# Altium schematic sheet ART-Pi_Content.SchDoc: Content
size A3; DocumentNumber: 1; Revision: V1.5; SheetNumber: 1; SheetTotal: 11; PageSetup: Record=PageOptions|CenterHorizontal=True|CenterVertical=True|PrintScale=1.01|XCorrection=1.00|YCorrection=1.00|PrintKind=0|BorderSize=5000000|LeftOffset=0|BottomOffset=0|Orientation=2|PaperLength=1000|PaperWidth=1000|Scale=100|PaperSource=7|PrintQuality=600|MediaType=1|DitherType=10|PrintScaleMode=1|PaperKind=A3(297x420mm)|PaperIndex=8
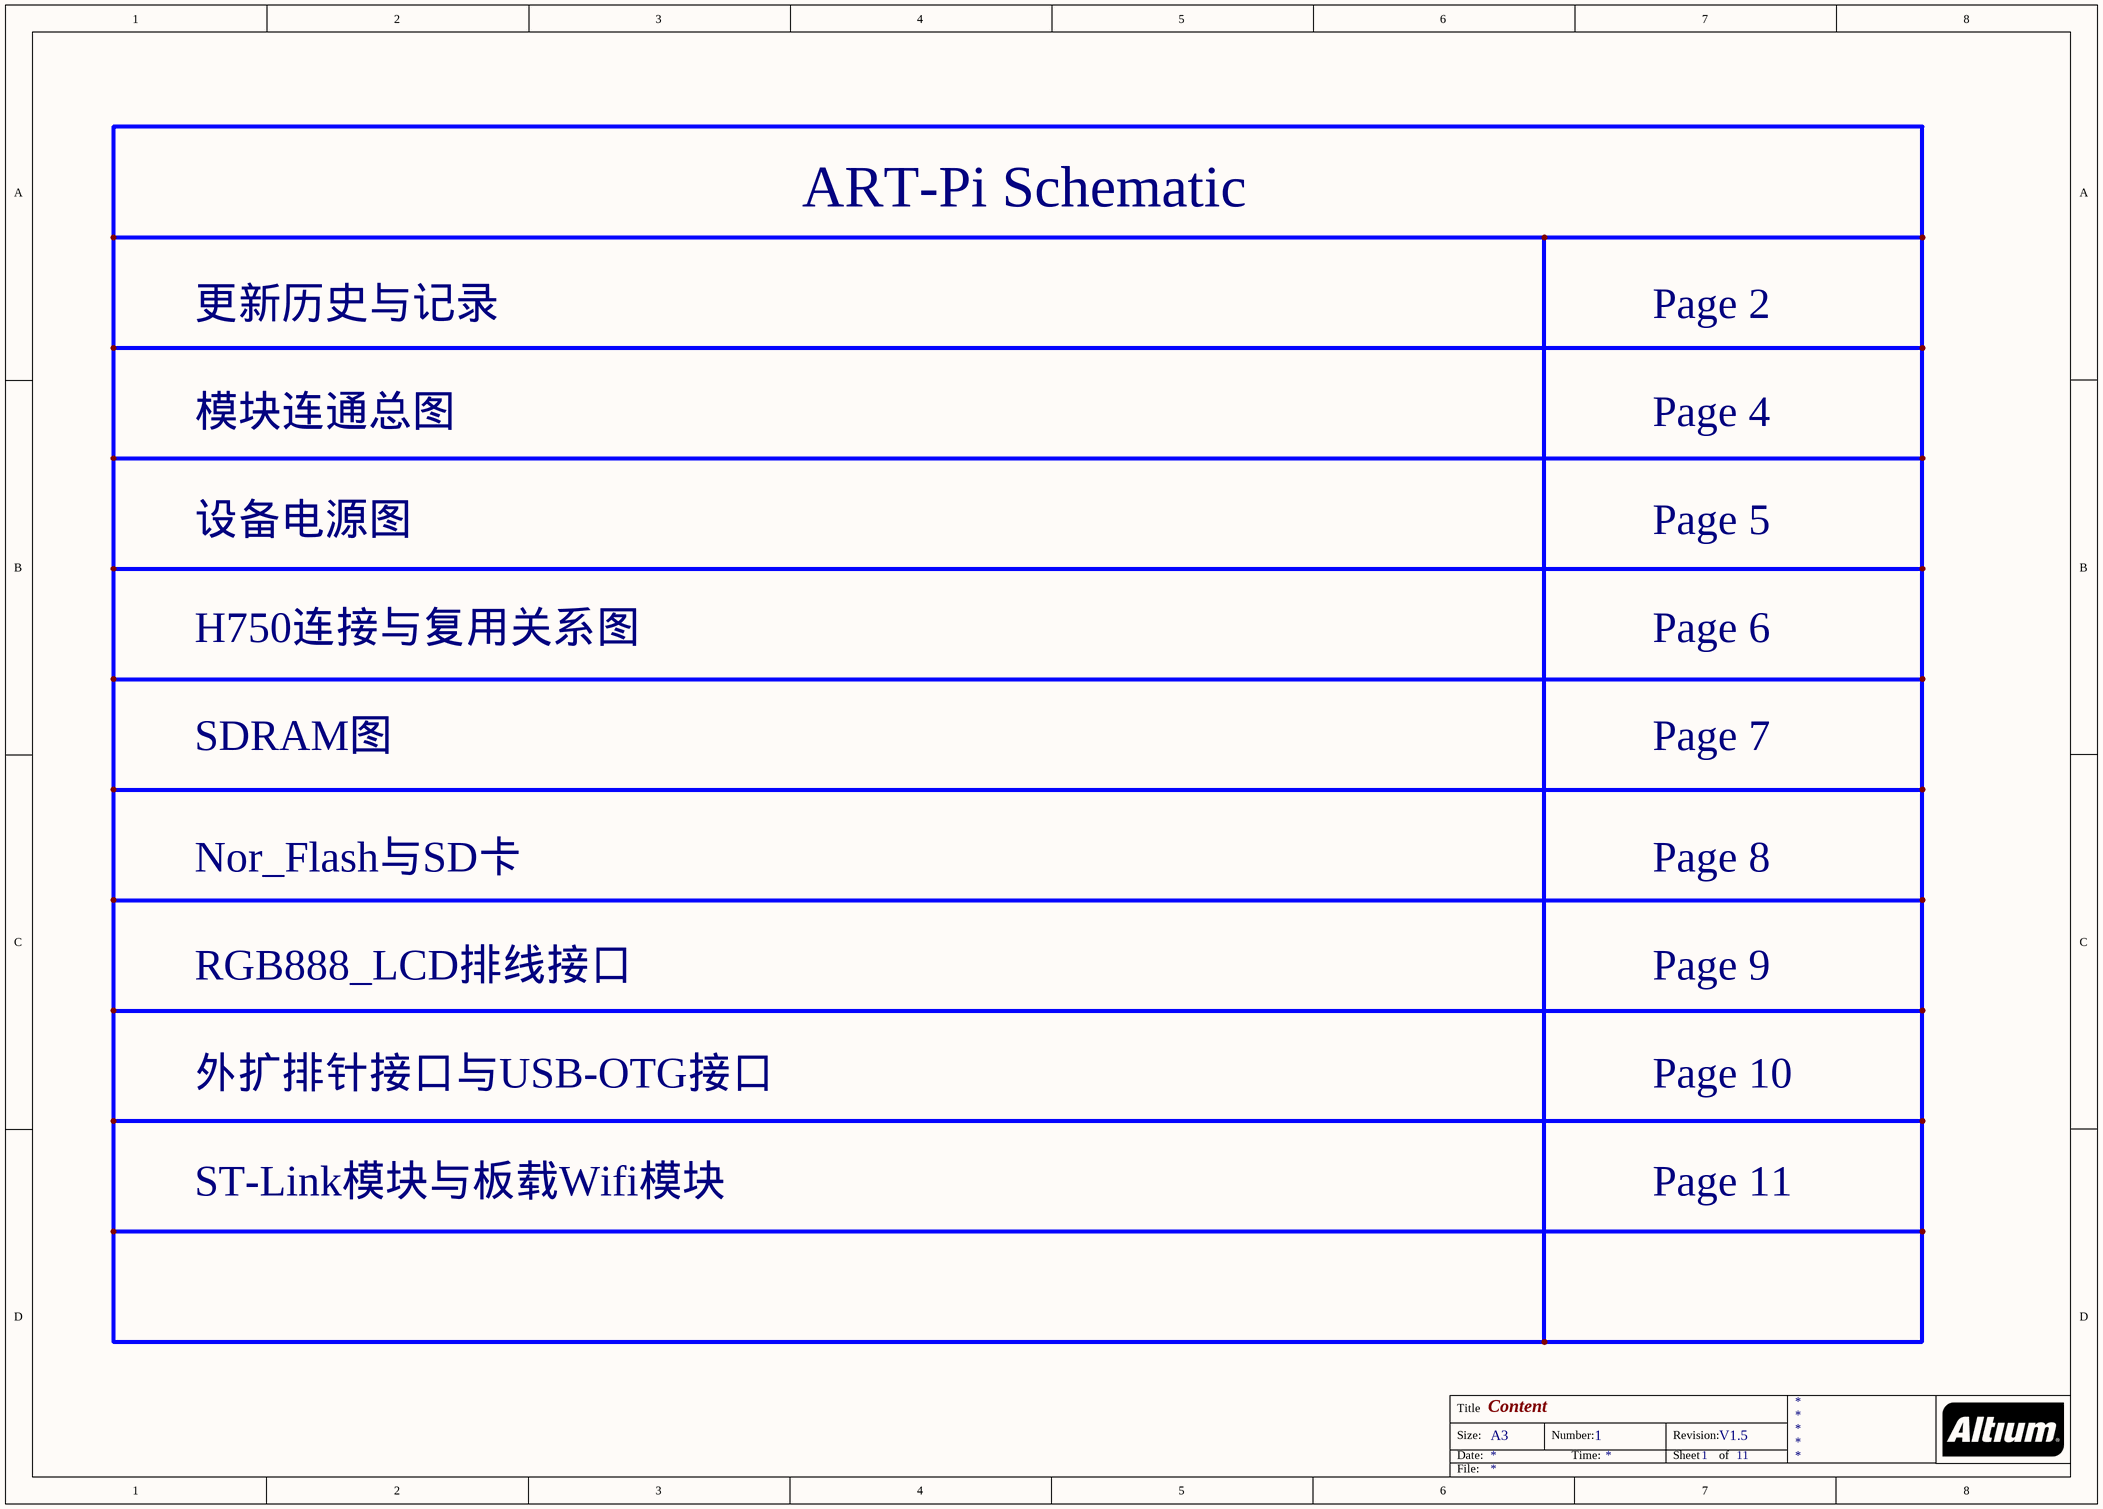
[diagram p0: ART-Pi_Content.SchDoc]

## Notes on the sheet
- ART-Pi Schematic
- 更新历史与记录
- Page 2
- 模块连通总图
- Page 4
- 设备电源图
- Page 5
- H750连接与复用关系图
- Page 6
- SDRAM图
- Page 7
- Nor_Flash与SD卡
- Page 8
- RGB888_LCD排线接口
- Page 9
- 外扩排针接口与USB-OTG接口
- Page 10
- ST-Link模块与板载Wifi模块
- Page 11
- Title
- Size:
- Date:
- A3
- Number:
- Time:
- Revision:
- Sheet
- of
- File: